# EAGLE schematic circadian rev2.0 (EAGLE 9.5.1)

## Sheet 1 of 6: LEDs
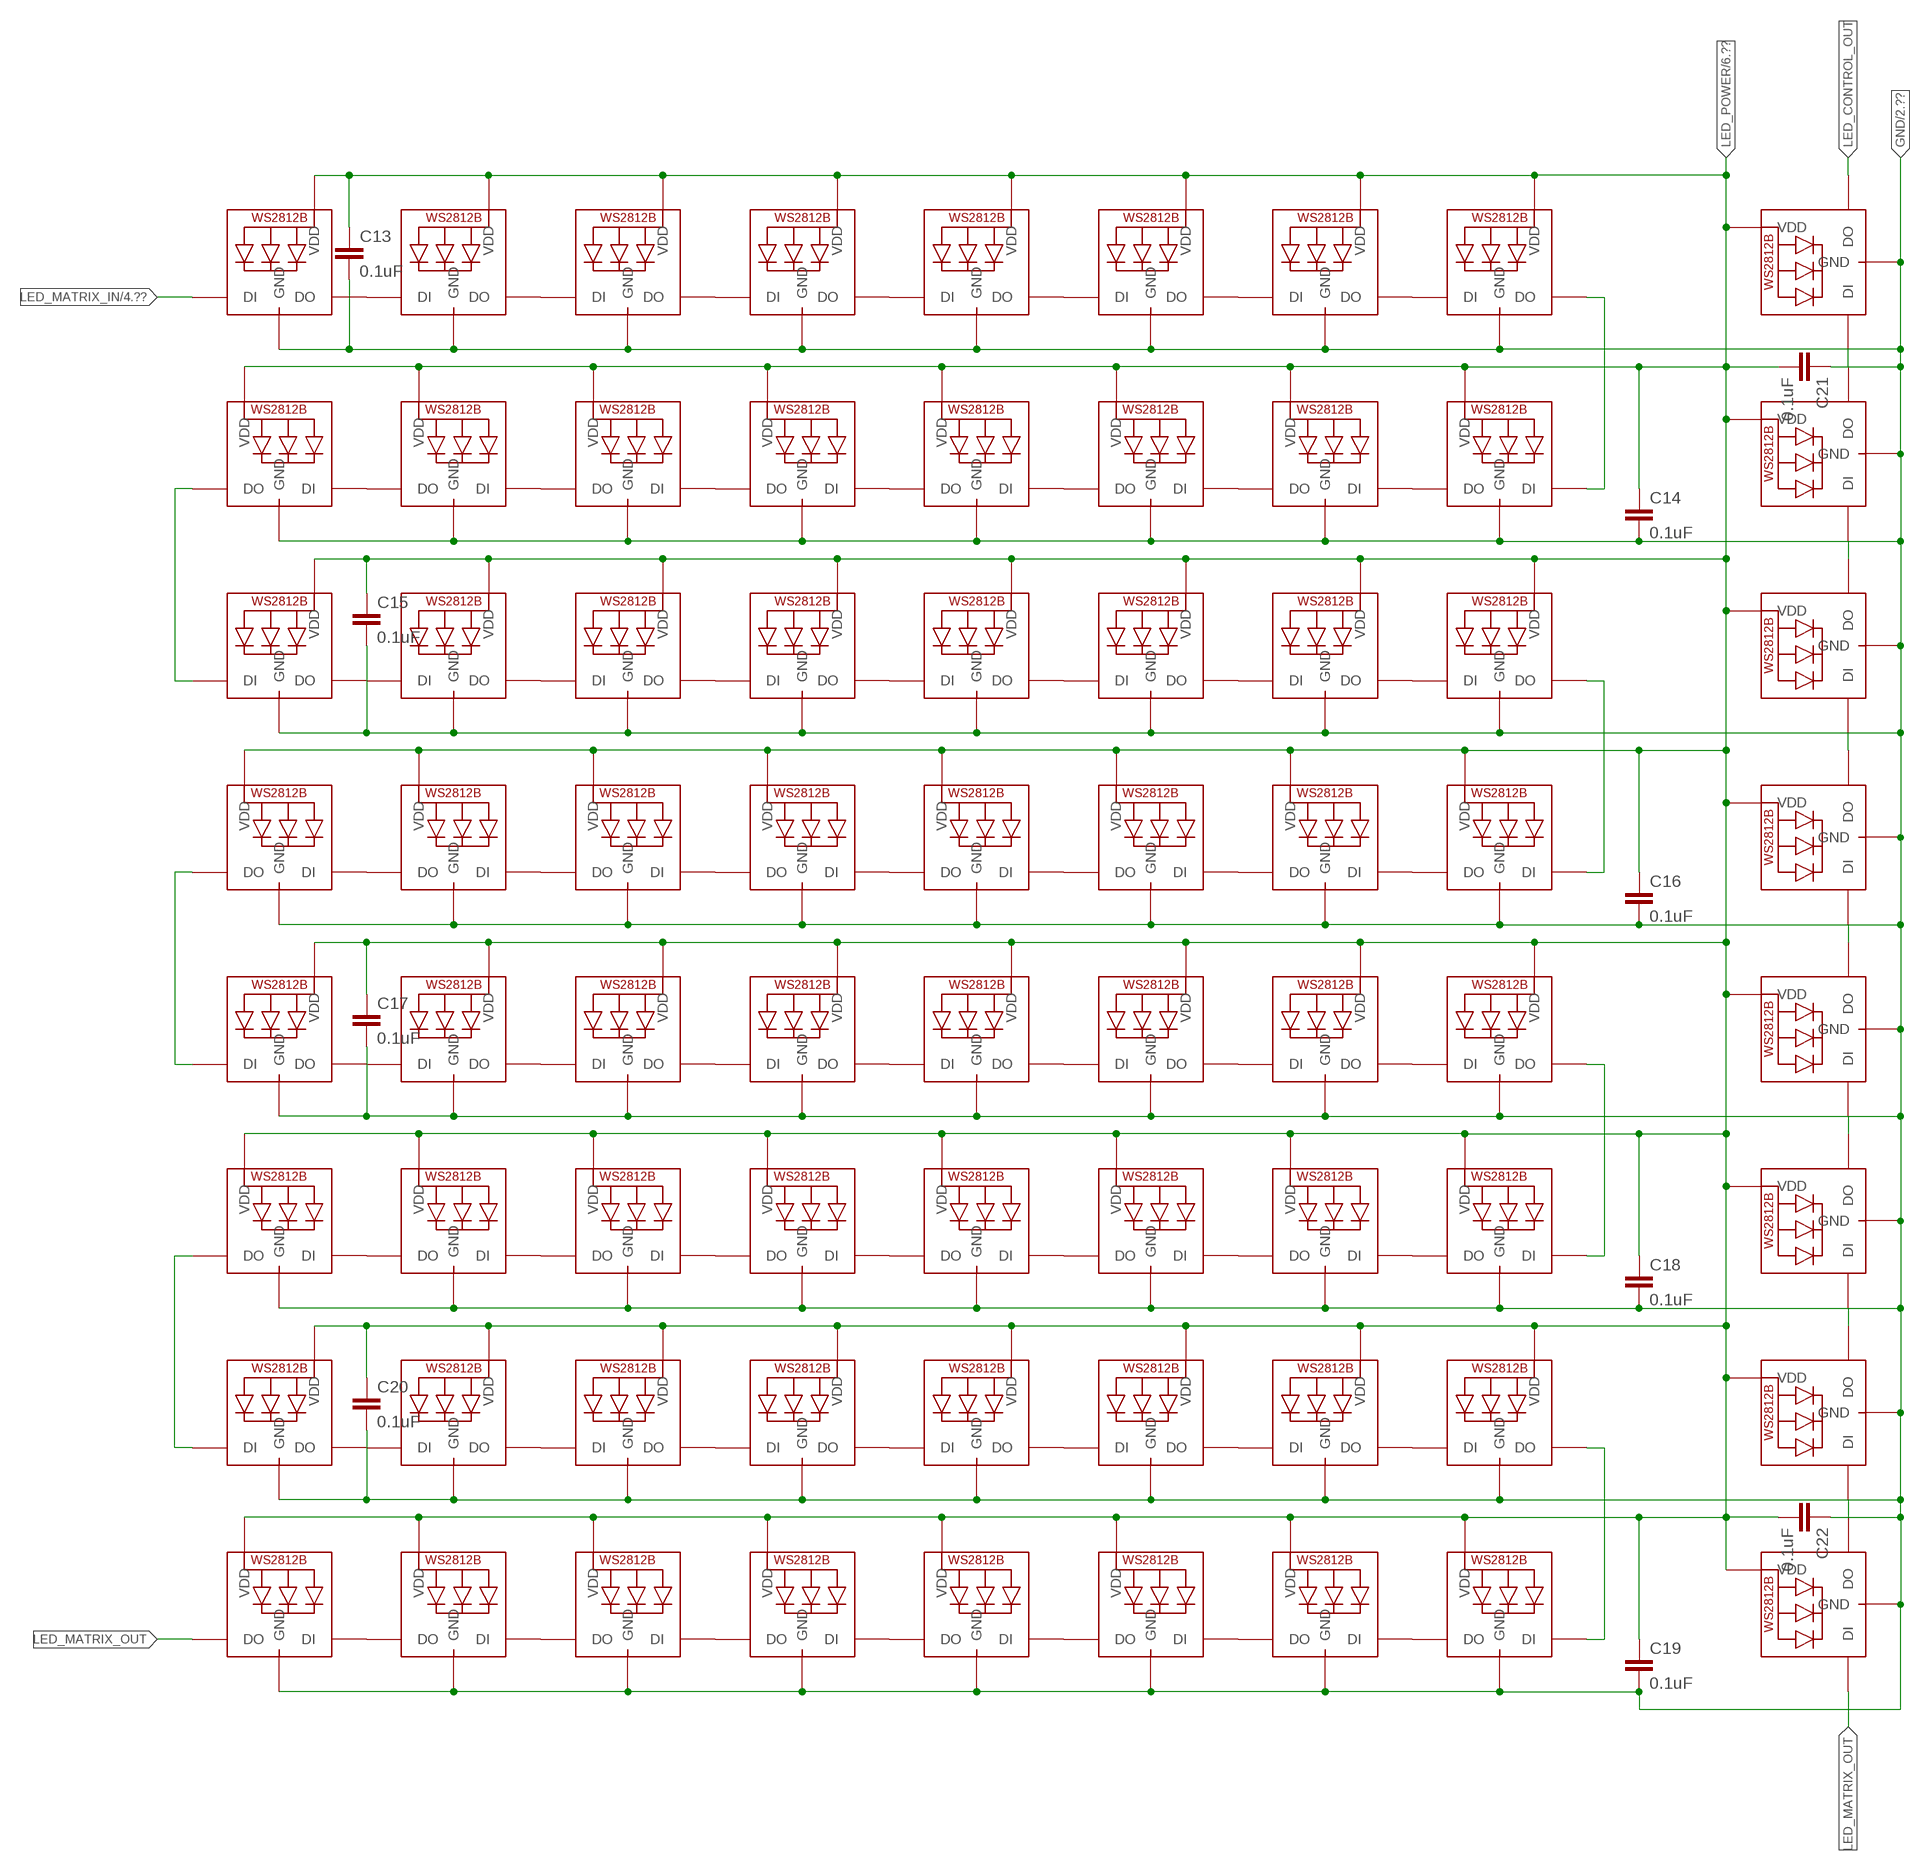
[diagram p0: schematic, sheet 1]

### Parts
C13  0.1uF  0.1UF-0603-25V-(+80/-20%)  [0603]
C14  0.1uF  0.1UF-0603-25V-(+80/-20%)  [0603]
C15  0.1uF  0.1UF-0603-25V-(+80/-20%)  [0603]
C16  0.1uF  0.1UF-0603-25V-(+80/-20%)  [0603]
C17  0.1uF  0.1UF-0603-25V-(+80/-20%)  [0603]
C18  0.1uF  0.1UF-0603-25V-(+80/-20%)  [0603]
C19  0.1uF  0.1UF-0603-25V-(+80/-20%)  [0603]
C20  0.1uF  0.1UF-0603-25V-(+80/-20%)  [0603]
C21  0.1uF  0.1UF-0603-25V-(+80/-20%)  [0603]
C22  0.1uF  0.1UF-0603-25V-(+80/-20%)  [0603]
LED1  WS2812B3535  [LED3535]
LED2  WS2812B3535  [LED3535]
LED3  WS2812B3535  [LED3535]
LED4  WS2812B3535  [LED3535]
LED5  WS2812B3535  [LED3535]
LED6  WS2812B3535  [LED3535]
LED7  WS2812B3535  [LED3535]
LED8  WS2812B3535  [LED3535]
LED9  WS2812B3535  [LED3535]
LED10  WS2812B3535  [LED3535]
LED11  WS2812B3535  [LED3535]
LED12  WS2812B3535  [LED3535]
LED13  WS2812B3535  [LED3535]
LED14  WS2812B3535  [LED3535]
LED15  WS2812B3535  [LED3535]
LED16  WS2812B3535  [LED3535]
LED17  WS2812B3535  [LED3535]
LED18  WS2812B3535  [LED3535]
LED19  WS2812B3535  [LED3535]
LED20  WS2812B3535  [LED3535]
LED21  WS2812B3535  [LED3535]
LED22  WS2812B3535  [LED3535]
LED23  WS2812B3535  [LED3535]
LED24  WS2812B3535  [LED3535]
LED25  WS2812B3535  [LED3535]
LED26  WS2812B3535  [LED3535]
LED27  WS2812B3535  [LED3535]
LED28  WS2812B3535  [LED3535]
LED29  WS2812B3535  [LED3535]
LED30  WS2812B3535  [LED3535]
LED31  WS2812B3535  [LED3535]
LED32  WS2812B3535  [LED3535]
LED33  WS2812B3535  [LED3535]
LED34  WS2812B3535  [LED3535]
LED35  WS2812B3535  [LED3535]
LED36  WS2812B3535  [LED3535]
LED37  WS2812B3535  [LED3535]
LED38  WS2812B3535  [LED3535]
LED39  WS2812B3535  [LED3535]
LED40  WS2812B3535  [LED3535]
LED41  WS2812B3535  [LED3535]
LED42  WS2812B3535  [LED3535]
LED43  WS2812B3535  [LED3535]
LED44  WS2812B3535  [LED3535]
LED45  WS2812B3535  [LED3535]
LED46  WS2812B3535  [LED3535]
LED47  WS2812B3535  [LED3535]
LED48  WS2812B3535  [LED3535]
LED49  WS2812B3535  [LED3535]
LED50  WS2812B3535  [LED3535]
LED51  WS2812B3535  [LED3535]
LED52  WS2812B3535  [LED3535]
LED53  WS2812B3535  [LED3535]
LED54  WS2812B3535  [LED3535]
LED55  WS2812B3535  [LED3535]
LED56  WS2812B3535  [LED3535]
LED57  WS2812B3535  [LED3535]
LED58  WS2812B3535  [LED3535]
LED59  WS2812B3535  [LED3535]
LED60  WS2812B3535  [LED3535]
LED61  WS2812B3535  [LED3535]
LED62  WS2812B3535  [LED3535]
LED63  WS2812B3535  [LED3535]
LED64  WS2812B3535  [LED3535]
LED65  WS2812B3535  [LED3535]
LED66  WS2812B3535  [LED3535]
LED67  WS2812B3535  [LED3535]
LED68  WS2812B3535  [LED3535]
LED69  WS2812B3535  [LED3535]
LED70  WS2812B3535  [LED3535]
LED71  WS2812B3535  [LED3535]
LED72  WS2812B3535  [LED3535]

### Nets
GND: C13.2 C14.2 C15.2 C16.2 C17.2 C18.2 C19.2 C20.2 C21.1 C22.1 LED1.4(GND) LED2.4(GND) LED3.4(GND) LED4.4(GND) LED5.4(GND) LED6.4(GND) LED7.4(GND) LED8.4(GND) LED9.4(GND) LED10.4(GND) LED11.4(GND) LED12.4(GND) LED13.4(GND) LED14.4(GND) LED15.4(GND) LED16.4(GND) LED17.4(GND) LED18.4(GND) LED19.4(GND) LED20.4(GND) LED21.4(GND) LED22.4(GND) LED23.4(GND) LED24.4(GND) LED25.4(GND) LED26.4(GND) LED27.4(GND) LED28.4(GND) LED29.4(GND) LED30.4(GND) LED31.4(GND) LED32.4(GND) LED33.4(GND) LED34.4(GND) LED35.4(GND) LED36.4(GND) LED37.4(GND) LED38.4(GND) LED39.4(GND) LED40.4(GND) LED41.4(GND) LED42.4(GND) LED43.4(GND) LED44.4(GND) LED45.4(GND) LED46.4(GND) LED47.4(GND) LED48.4(GND) LED49.4(GND) LED50.4(GND) LED51.4(GND) LED52.4(GND) LED53.4(GND) LED54.4(GND) LED55.4(GND) LED56.4(GND) LED57.4(GND) LED58.4(GND) LED59.4(GND) LED60.4(GND) LED61.4(GND) LED62.4(GND) LED63.4(GND) LED64.4(GND) LED65.4(GND) LED66.4(GND) LED67.4(GND) LED68.4(GND) LED69.4(GND) LED70.4(GND) LED71.4(GND) LED72.4(GND) ; also sheet 2,3,4,5,6
LED_CONTROL_OUT: LED65.3(DO)
LED_MATRIX_IN: LED1.1(DI) ; also sheet 4
LED_MATRIX_OUT: LED64.3(DO) LED72.1(DI)
LED_POWER: C13.1 C14.1 C15.1 C16.1 C17.1 C18.1 C19.1 C20.1 C21.2 C22.2 LED1.2(VDD) LED2.2(VDD) LED3.2(VDD) LED4.2(VDD) LED5.2(VDD) LED6.2(VDD) LED7.2(VDD) LED8.2(VDD) LED9.2(VDD) LED10.2(VDD) LED11.2(VDD) LED12.2(VDD) LED13.2(VDD) LED14.2(VDD) LED15.2(VDD) LED16.2(VDD) LED17.2(VDD) LED18.2(VDD) LED19.2(VDD) LED20.2(VDD) LED21.2(VDD) LED22.2(VDD) LED23.2(VDD) LED24.2(VDD) LED25.2(VDD) LED26.2(VDD) LED27.2(VDD) LED28.2(VDD) LED29.2(VDD) LED30.2(VDD) LED31.2(VDD) LED32.2(VDD) LED33.2(VDD) LED34.2(VDD) LED35.2(VDD) LED36.2(VDD) LED37.2(VDD) LED38.2(VDD) LED39.2(VDD) LED40.2(VDD) LED41.2(VDD) LED42.2(VDD) LED43.2(VDD) LED44.2(VDD) LED45.2(VDD) LED46.2(VDD) LED47.2(VDD) LED48.2(VDD) LED49.2(VDD) LED50.2(VDD) LED51.2(VDD) LED52.2(VDD) LED53.2(VDD) LED54.2(VDD) LED55.2(VDD) LED56.2(VDD) LED57.2(VDD) LED58.2(VDD) LED59.2(VDD) LED60.2(VDD) LED61.2(VDD) LED62.2(VDD) LED63.2(VDD) LED64.2(VDD) LED65.2(VDD) LED66.2(VDD) LED67.2(VDD) LED68.2(VDD) LED69.2(VDD) LED70.2(VDD) LED71.2(VDD) LED72.2(VDD) ; also sheet 6
N$3: LED9.3(DO) LED10.1(DI)
N$4: LED10.3(DO) LED11.1(DI)
N$5: LED11.3(DO) LED12.1(DI)
N$6: LED12.3(DO) LED13.1(DI)
N$7: LED13.3(DO) LED14.1(DI)
N$8: LED14.3(DO) LED15.1(DI)
N$9: LED15.3(DO) LED16.1(DI)
N$12: LED8.3(DO) LED9.1(DI)
N$13: LED17.3(DO) LED18.1(DI)
N$14: LED18.3(DO) LED19.1(DI)
N$15: LED19.3(DO) LED20.1(DI)
N$16: LED20.3(DO) LED21.1(DI)
N$17: LED21.3(DO) LED22.1(DI)
N$18: LED22.3(DO) LED23.1(DI)
N$19: LED23.3(DO) LED24.1(DI)
N$22: LED1.3(DO) LED2.1(DI)
N$23: LED2.3(DO) LED3.1(DI)
N$24: LED3.3(DO) LED4.1(DI)
N$25: LED4.3(DO) LED5.1(DI)
N$26: LED5.3(DO) LED6.1(DI)
N$27: LED6.3(DO) LED7.1(DI)
N$28: LED7.3(DO) LED8.1(DI)
N$29: LED25.3(DO) LED26.1(DI)
N$30: LED26.3(DO) LED27.1(DI)
N$31: LED27.3(DO) LED28.1(DI)
N$32: LED28.3(DO) LED29.1(DI)
N$33: LED29.3(DO) LED30.1(DI)
N$34: LED30.3(DO) LED31.1(DI)
N$35: LED31.3(DO) LED32.1(DI)
N$38: LED24.3(DO) LED25.1(DI)
N$39: LED33.3(DO) LED34.1(DI)
N$40: LED34.3(DO) LED35.1(DI)
N$41: LED35.3(DO) LED36.1(DI)
N$42: LED36.3(DO) LED37.1(DI)
N$43: LED37.3(DO) LED38.1(DI)
N$44: LED38.3(DO) LED39.1(DI)
N$45: LED39.3(DO) LED40.1(DI)
N$48: LED41.3(DO) LED42.1(DI)
N$49: LED42.3(DO) LED43.1(DI)
N$50: LED43.3(DO) LED44.1(DI)
N$51: LED44.3(DO) LED45.1(DI)
N$52: LED45.3(DO) LED46.1(DI)
N$53: LED46.3(DO) LED47.1(DI)
N$54: LED47.3(DO) LED48.1(DI)
N$57: LED40.3(DO) LED41.1(DI)
N$58: LED49.3(DO) LED50.1(DI)
N$59: LED50.3(DO) LED51.1(DI)
N$60: LED51.3(DO) LED52.1(DI)
N$61: LED52.3(DO) LED53.1(DI)
N$62: LED53.3(DO) LED54.1(DI)
N$63: LED54.3(DO) LED55.1(DI)
N$64: LED55.3(DO) LED56.1(DI)
N$67: LED57.3(DO) LED58.1(DI)
N$68: LED58.3(DO) LED59.1(DI)
N$69: LED59.3(DO) LED60.1(DI)
N$70: LED60.3(DO) LED61.1(DI)
N$71: LED61.3(DO) LED62.1(DI)
N$72: LED62.3(DO) LED63.1(DI)
N$73: LED63.3(DO) LED64.1(DI)
N$76: LED56.3(DO) LED57.1(DI)
N$77: LED16.3(DO) LED17.1(DI)
N$78: LED32.3(DO) LED33.1(DI)
N$79: LED48.3(DO) LED49.1(DI)
N$81: LED66.1(DI) LED67.3(DO)
N$82: LED67.1(DI) LED68.3(DO)
N$83: LED68.1(DI) LED69.3(DO)
N$84: LED69.1(DI) LED70.3(DO)
N$85: LED70.1(DI) LED71.3(DO)
N$86: LED71.1(DI) LED72.3(DO)
N$116: LED65.1(DI) LED66.3(DO)

## Sheet 2 of 6: Buttons
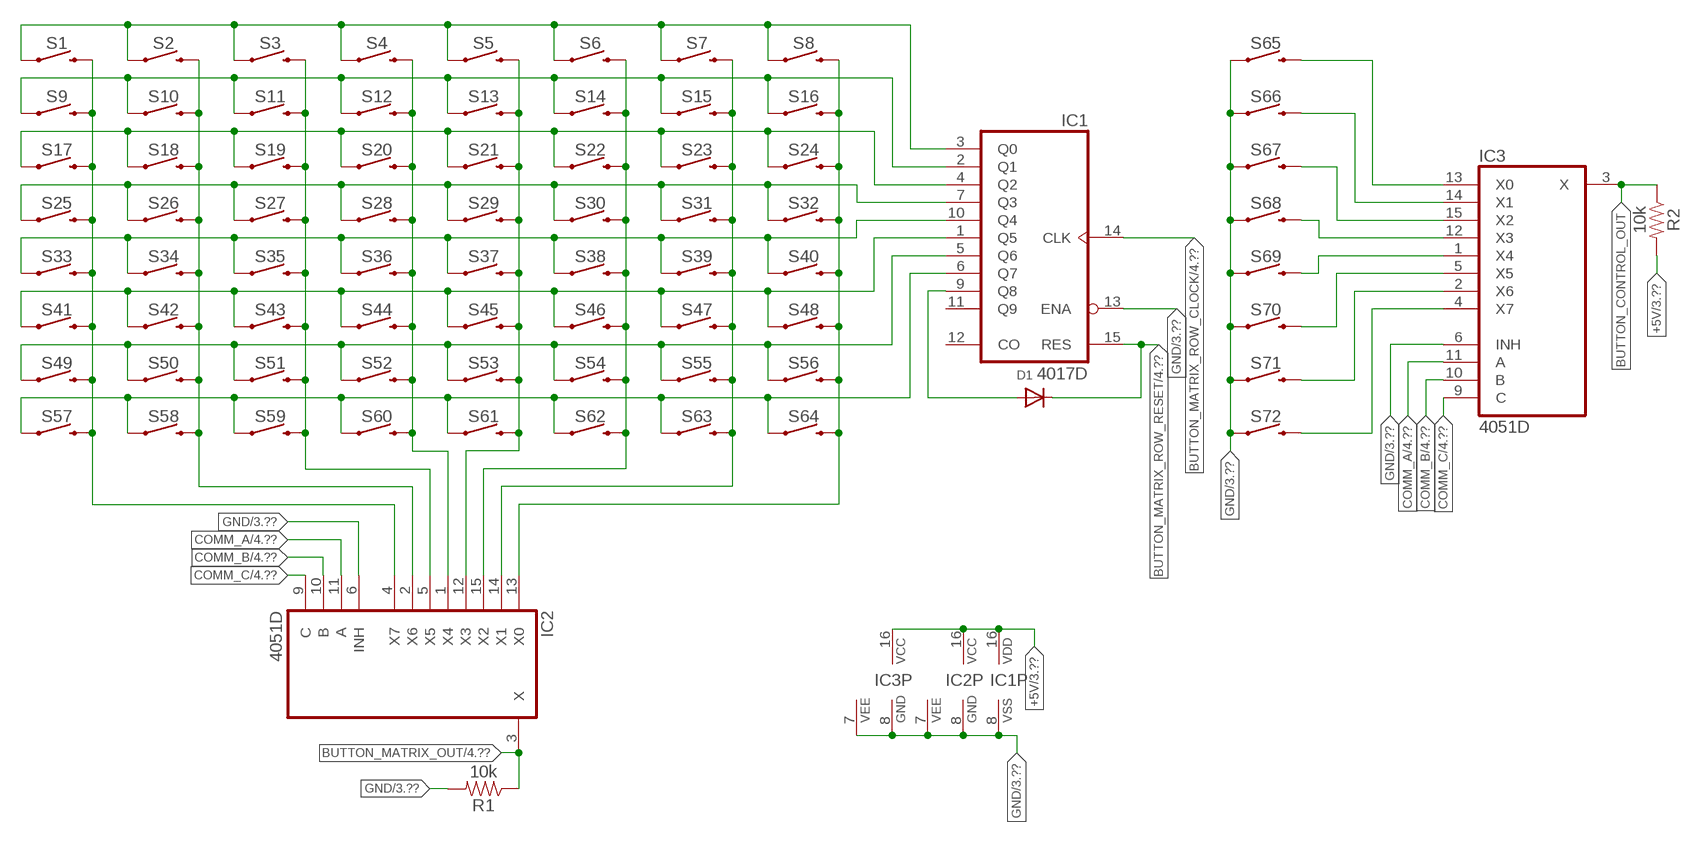
[diagram p1: schematic, sheet 2]

### Parts
D1  DIODESOD-123  [SOD-123]
IC1  4017D  [SO16]
IC2  4051D  [SO16]
IC3  4051D  [SO16]
R1  10k  10KOHM-0603-1/10W-1%  [0603]
R2  10k  10KOHM-0603-1/10W-1%  [0603]
S1  MOMENTARY-SWITCH-SPST-SMD-6.0X3.5MM  [TACTILE_SWITCH_SMD_6.0X3.5MM]
S2  MOMENTARY-SWITCH-SPST-SMD-6.0X3.5MM  [TACTILE_SWITCH_SMD_6.0X3.5MM]
S3  MOMENTARY-SWITCH-SPST-SMD-6.0X3.5MM  [TACTILE_SWITCH_SMD_6.0X3.5MM]
S4  MOMENTARY-SWITCH-SPST-SMD-6.0X3.5MM  [TACTILE_SWITCH_SMD_6.0X3.5MM]
S5  MOMENTARY-SWITCH-SPST-SMD-6.0X3.5MM  [TACTILE_SWITCH_SMD_6.0X3.5MM]
S6  MOMENTARY-SWITCH-SPST-SMD-6.0X3.5MM  [TACTILE_SWITCH_SMD_6.0X3.5MM]
S7  MOMENTARY-SWITCH-SPST-SMD-6.0X3.5MM  [TACTILE_SWITCH_SMD_6.0X3.5MM]
S8  MOMENTARY-SWITCH-SPST-SMD-6.0X3.5MM  [TACTILE_SWITCH_SMD_6.0X3.5MM]
S9  MOMENTARY-SWITCH-SPST-SMD-6.0X3.5MM  [TACTILE_SWITCH_SMD_6.0X3.5MM]
S10  MOMENTARY-SWITCH-SPST-SMD-6.0X3.5MM  [TACTILE_SWITCH_SMD_6.0X3.5MM]
S11  MOMENTARY-SWITCH-SPST-SMD-6.0X3.5MM  [TACTILE_SWITCH_SMD_6.0X3.5MM]
S12  MOMENTARY-SWITCH-SPST-SMD-6.0X3.5MM  [TACTILE_SWITCH_SMD_6.0X3.5MM]
S13  MOMENTARY-SWITCH-SPST-SMD-6.0X3.5MM  [TACTILE_SWITCH_SMD_6.0X3.5MM]
S14  MOMENTARY-SWITCH-SPST-SMD-6.0X3.5MM  [TACTILE_SWITCH_SMD_6.0X3.5MM]
S15  MOMENTARY-SWITCH-SPST-SMD-6.0X3.5MM  [TACTILE_SWITCH_SMD_6.0X3.5MM]
S16  MOMENTARY-SWITCH-SPST-SMD-6.0X3.5MM  [TACTILE_SWITCH_SMD_6.0X3.5MM]
S17  MOMENTARY-SWITCH-SPST-SMD-6.0X3.5MM  [TACTILE_SWITCH_SMD_6.0X3.5MM]
S18  MOMENTARY-SWITCH-SPST-SMD-6.0X3.5MM  [TACTILE_SWITCH_SMD_6.0X3.5MM]
S19  MOMENTARY-SWITCH-SPST-SMD-6.0X3.5MM  [TACTILE_SWITCH_SMD_6.0X3.5MM]
S20  MOMENTARY-SWITCH-SPST-SMD-6.0X3.5MM  [TACTILE_SWITCH_SMD_6.0X3.5MM]
S21  MOMENTARY-SWITCH-SPST-SMD-6.0X3.5MM  [TACTILE_SWITCH_SMD_6.0X3.5MM]
S22  MOMENTARY-SWITCH-SPST-SMD-6.0X3.5MM  [TACTILE_SWITCH_SMD_6.0X3.5MM]
S23  MOMENTARY-SWITCH-SPST-SMD-6.0X3.5MM  [TACTILE_SWITCH_SMD_6.0X3.5MM]
S24  MOMENTARY-SWITCH-SPST-SMD-6.0X3.5MM  [TACTILE_SWITCH_SMD_6.0X3.5MM]
S25  MOMENTARY-SWITCH-SPST-SMD-6.0X3.5MM  [TACTILE_SWITCH_SMD_6.0X3.5MM]
S26  MOMENTARY-SWITCH-SPST-SMD-6.0X3.5MM  [TACTILE_SWITCH_SMD_6.0X3.5MM]
S27  MOMENTARY-SWITCH-SPST-SMD-6.0X3.5MM  [TACTILE_SWITCH_SMD_6.0X3.5MM]
S28  MOMENTARY-SWITCH-SPST-SMD-6.0X3.5MM  [TACTILE_SWITCH_SMD_6.0X3.5MM]
S29  MOMENTARY-SWITCH-SPST-SMD-6.0X3.5MM  [TACTILE_SWITCH_SMD_6.0X3.5MM]
S30  MOMENTARY-SWITCH-SPST-SMD-6.0X3.5MM  [TACTILE_SWITCH_SMD_6.0X3.5MM]
S31  MOMENTARY-SWITCH-SPST-SMD-6.0X3.5MM  [TACTILE_SWITCH_SMD_6.0X3.5MM]
S32  MOMENTARY-SWITCH-SPST-SMD-6.0X3.5MM  [TACTILE_SWITCH_SMD_6.0X3.5MM]
S33  MOMENTARY-SWITCH-SPST-SMD-6.0X3.5MM  [TACTILE_SWITCH_SMD_6.0X3.5MM]
S34  MOMENTARY-SWITCH-SPST-SMD-6.0X3.5MM  [TACTILE_SWITCH_SMD_6.0X3.5MM]
S35  MOMENTARY-SWITCH-SPST-SMD-6.0X3.5MM  [TACTILE_SWITCH_SMD_6.0X3.5MM]
S36  MOMENTARY-SWITCH-SPST-SMD-6.0X3.5MM  [TACTILE_SWITCH_SMD_6.0X3.5MM]
S37  MOMENTARY-SWITCH-SPST-SMD-6.0X3.5MM  [TACTILE_SWITCH_SMD_6.0X3.5MM]
S38  MOMENTARY-SWITCH-SPST-SMD-6.0X3.5MM  [TACTILE_SWITCH_SMD_6.0X3.5MM]
S39  MOMENTARY-SWITCH-SPST-SMD-6.0X3.5MM  [TACTILE_SWITCH_SMD_6.0X3.5MM]
S40  MOMENTARY-SWITCH-SPST-SMD-6.0X3.5MM  [TACTILE_SWITCH_SMD_6.0X3.5MM]
S41  MOMENTARY-SWITCH-SPST-SMD-6.0X3.5MM  [TACTILE_SWITCH_SMD_6.0X3.5MM]
S42  MOMENTARY-SWITCH-SPST-SMD-6.0X3.5MM  [TACTILE_SWITCH_SMD_6.0X3.5MM]
S43  MOMENTARY-SWITCH-SPST-SMD-6.0X3.5MM  [TACTILE_SWITCH_SMD_6.0X3.5MM]
S44  MOMENTARY-SWITCH-SPST-SMD-6.0X3.5MM  [TACTILE_SWITCH_SMD_6.0X3.5MM]
S45  MOMENTARY-SWITCH-SPST-SMD-6.0X3.5MM  [TACTILE_SWITCH_SMD_6.0X3.5MM]
S46  MOMENTARY-SWITCH-SPST-SMD-6.0X3.5MM  [TACTILE_SWITCH_SMD_6.0X3.5MM]
S47  MOMENTARY-SWITCH-SPST-SMD-6.0X3.5MM  [TACTILE_SWITCH_SMD_6.0X3.5MM]
S48  MOMENTARY-SWITCH-SPST-SMD-6.0X3.5MM  [TACTILE_SWITCH_SMD_6.0X3.5MM]
S49  MOMENTARY-SWITCH-SPST-SMD-6.0X3.5MM  [TACTILE_SWITCH_SMD_6.0X3.5MM]
S50  MOMENTARY-SWITCH-SPST-SMD-6.0X3.5MM  [TACTILE_SWITCH_SMD_6.0X3.5MM]
S51  MOMENTARY-SWITCH-SPST-SMD-6.0X3.5MM  [TACTILE_SWITCH_SMD_6.0X3.5MM]
S52  MOMENTARY-SWITCH-SPST-SMD-6.0X3.5MM  [TACTILE_SWITCH_SMD_6.0X3.5MM]
S53  MOMENTARY-SWITCH-SPST-SMD-6.0X3.5MM  [TACTILE_SWITCH_SMD_6.0X3.5MM]
S54  MOMENTARY-SWITCH-SPST-SMD-6.0X3.5MM  [TACTILE_SWITCH_SMD_6.0X3.5MM]
S55  MOMENTARY-SWITCH-SPST-SMD-6.0X3.5MM  [TACTILE_SWITCH_SMD_6.0X3.5MM]
S56  MOMENTARY-SWITCH-SPST-SMD-6.0X3.5MM  [TACTILE_SWITCH_SMD_6.0X3.5MM]
S57  MOMENTARY-SWITCH-SPST-SMD-6.0X3.5MM  [TACTILE_SWITCH_SMD_6.0X3.5MM]
S58  MOMENTARY-SWITCH-SPST-SMD-6.0X3.5MM  [TACTILE_SWITCH_SMD_6.0X3.5MM]
S59  MOMENTARY-SWITCH-SPST-SMD-6.0X3.5MM  [TACTILE_SWITCH_SMD_6.0X3.5MM]
S60  MOMENTARY-SWITCH-SPST-SMD-6.0X3.5MM  [TACTILE_SWITCH_SMD_6.0X3.5MM]
S61  MOMENTARY-SWITCH-SPST-SMD-6.0X3.5MM  [TACTILE_SWITCH_SMD_6.0X3.5MM]
S62  MOMENTARY-SWITCH-SPST-SMD-6.0X3.5MM  [TACTILE_SWITCH_SMD_6.0X3.5MM]
S63  MOMENTARY-SWITCH-SPST-SMD-6.0X3.5MM  [TACTILE_SWITCH_SMD_6.0X3.5MM]
S64  MOMENTARY-SWITCH-SPST-SMD-6.0X3.5MM  [TACTILE_SWITCH_SMD_6.0X3.5MM]
S65  MOMENTARY-SWITCH-SPST-SMD-6.0X3.5MM  [TACTILE_SWITCH_SMD_6.0X3.5MM]
S66  MOMENTARY-SWITCH-SPST-SMD-6.0X3.5MM  [TACTILE_SWITCH_SMD_6.0X3.5MM]
S67  MOMENTARY-SWITCH-SPST-SMD-6.0X3.5MM  [TACTILE_SWITCH_SMD_6.0X3.5MM]
S68  MOMENTARY-SWITCH-SPST-SMD-6.0X3.5MM  [TACTILE_SWITCH_SMD_6.0X3.5MM]
S69  MOMENTARY-SWITCH-SPST-SMD-6.0X3.5MM  [TACTILE_SWITCH_SMD_6.0X3.5MM]
S70  MOMENTARY-SWITCH-SPST-SMD-6.0X3.5MM  [TACTILE_SWITCH_SMD_6.0X3.5MM]
S71  MOMENTARY-SWITCH-SPST-SMD-6.0X3.5MM  [TACTILE_SWITCH_SMD_6.0X3.5MM]
S72  MOMENTARY-SWITCH-SPST-SMD-6.0X3.5MM  [TACTILE_SWITCH_SMD_6.0X3.5MM]

### Nets
+5V: IC1.16(VDD) IC2.16(VCC) IC3.16(VCC) R2.2 ; also sheet 3,4,5,6
BUTTON_CONTROL_OUT: IC3.3(X) R2.1
BUTTON_MATRIX_COLLUM1: IC2.4(X7) S1.2 S9.2 S17.2 S25.2 S33.2 S41.2 S49.2 S57.2
BUTTON_MATRIX_COLLUM2: IC2.2(X6) S2.2 S10.2 S18.2 S26.2 S34.2 S42.2 S50.2 S58.2
BUTTON_MATRIX_COLLUM3: IC2.5(X5) S3.2 S11.2 S19.2 S27.2 S35.2 S43.2 S51.2 S59.2
BUTTON_MATRIX_COLLUM4: IC2.1(X4) S4.2 S12.2 S20.2 S28.2 S36.2 S44.2 S52.2 S60.2
BUTTON_MATRIX_COLLUM5: IC2.12(X3) S5.2 S13.2 S21.2 S29.2 S37.2 S45.2 S53.2 S61.2
BUTTON_MATRIX_COLLUM6: IC2.15(X2) S6.2 S14.2 S22.2 S30.2 S38.2 S46.2 S54.2 S62.2
BUTTON_MATRIX_COLLUM7: IC2.14(X1) S7.2 S15.2 S23.2 S31.2 S39.2 S47.2 S55.2 S63.2
BUTTON_MATRIX_COLLUM8: IC2.13(X0) S8.2 S16.2 S24.2 S32.2 S40.2 S48.2 S56.2 S64.2
BUTTON_MATRIX_OUT: IC2.3(X) R1.1 ; also sheet 4
BUTTON_MATRIX_ROW1: IC1.3(Q0) S1.1 S2.1 S3.1 S4.1 S5.1 S6.1 S7.1 S8.1
BUTTON_MATRIX_ROW2: IC1.2(Q1) S9.1 S10.1 S11.1 S12.1 S13.1 S14.1 S15.1 S16.1
BUTTON_MATRIX_ROW3: IC1.4(Q2) S17.1 S18.1 S19.1 S20.1 S21.1 S22.1 S23.1 S24.1
BUTTON_MATRIX_ROW4: IC1.7(Q3) S25.1 S26.1 S27.1 S28.1 S29.1 S30.1 S31.1 S32.1
BUTTON_MATRIX_ROW5: IC1.10(Q4) S33.1 S34.1 S35.1 S36.1 S37.1 S38.1 S39.1 S40.1
BUTTON_MATRIX_ROW6: IC1.1(Q5) S41.1 S42.1 S43.1 S44.1 S45.1 S46.1 S47.1 S48.1
BUTTON_MATRIX_ROW7: IC1.5(Q6) S49.1 S50.1 S51.1 S52.1 S53.1 S54.1 S55.1 S56.1
BUTTON_MATRIX_ROW8: IC1.6(Q7) S57.1 S58.1 S59.1 S60.1 S61.1 S62.1 S63.1 S64.1
BUTTON_MATRIX_ROW_CLOCK: IC1.14(CLK) ; also sheet 4
BUTTON_MATRIX_ROW_RESET: D1.C IC1.15(RES) ; also sheet 4
COMM_A: IC2.11(A) IC3.11(A) ; also sheet 4
COMM_B: IC2.10(B) IC3.10(B) ; also sheet 4
COMM_C: IC2.9(C) IC3.9(C) ; also sheet 4
GND: IC1.8(VSS) IC1.13(ENA) IC2.6(INH) IC2.7(VEE) IC2.8(GND) IC3.6(INH) IC3.7(VEE) IC3.8(GND) R1.2 S65.1 S66.1 S67.1 S68.1 S69.1 S70.1 S71.1 S72.1 ; also sheet 1,3,4,5,6
N$2: IC3.12(X3) S68.2
N$10: IC3.1(X4) S69.2
N$11: IC3.5(X5) S70.2
N$20: IC3.15(X2) S67.2
N$21: IC3.14(X1) S66.2
N$36: IC3.13(X0) S65.2
N$37: IC3.2(X6) S71.2
N$46: IC3.4(X7) S72.2
N$102: D1.A IC1.9(Q8)
Unconnected: IC1.11(Q9) IC1.12(CO)

## Sheet 3 of 6: other UI
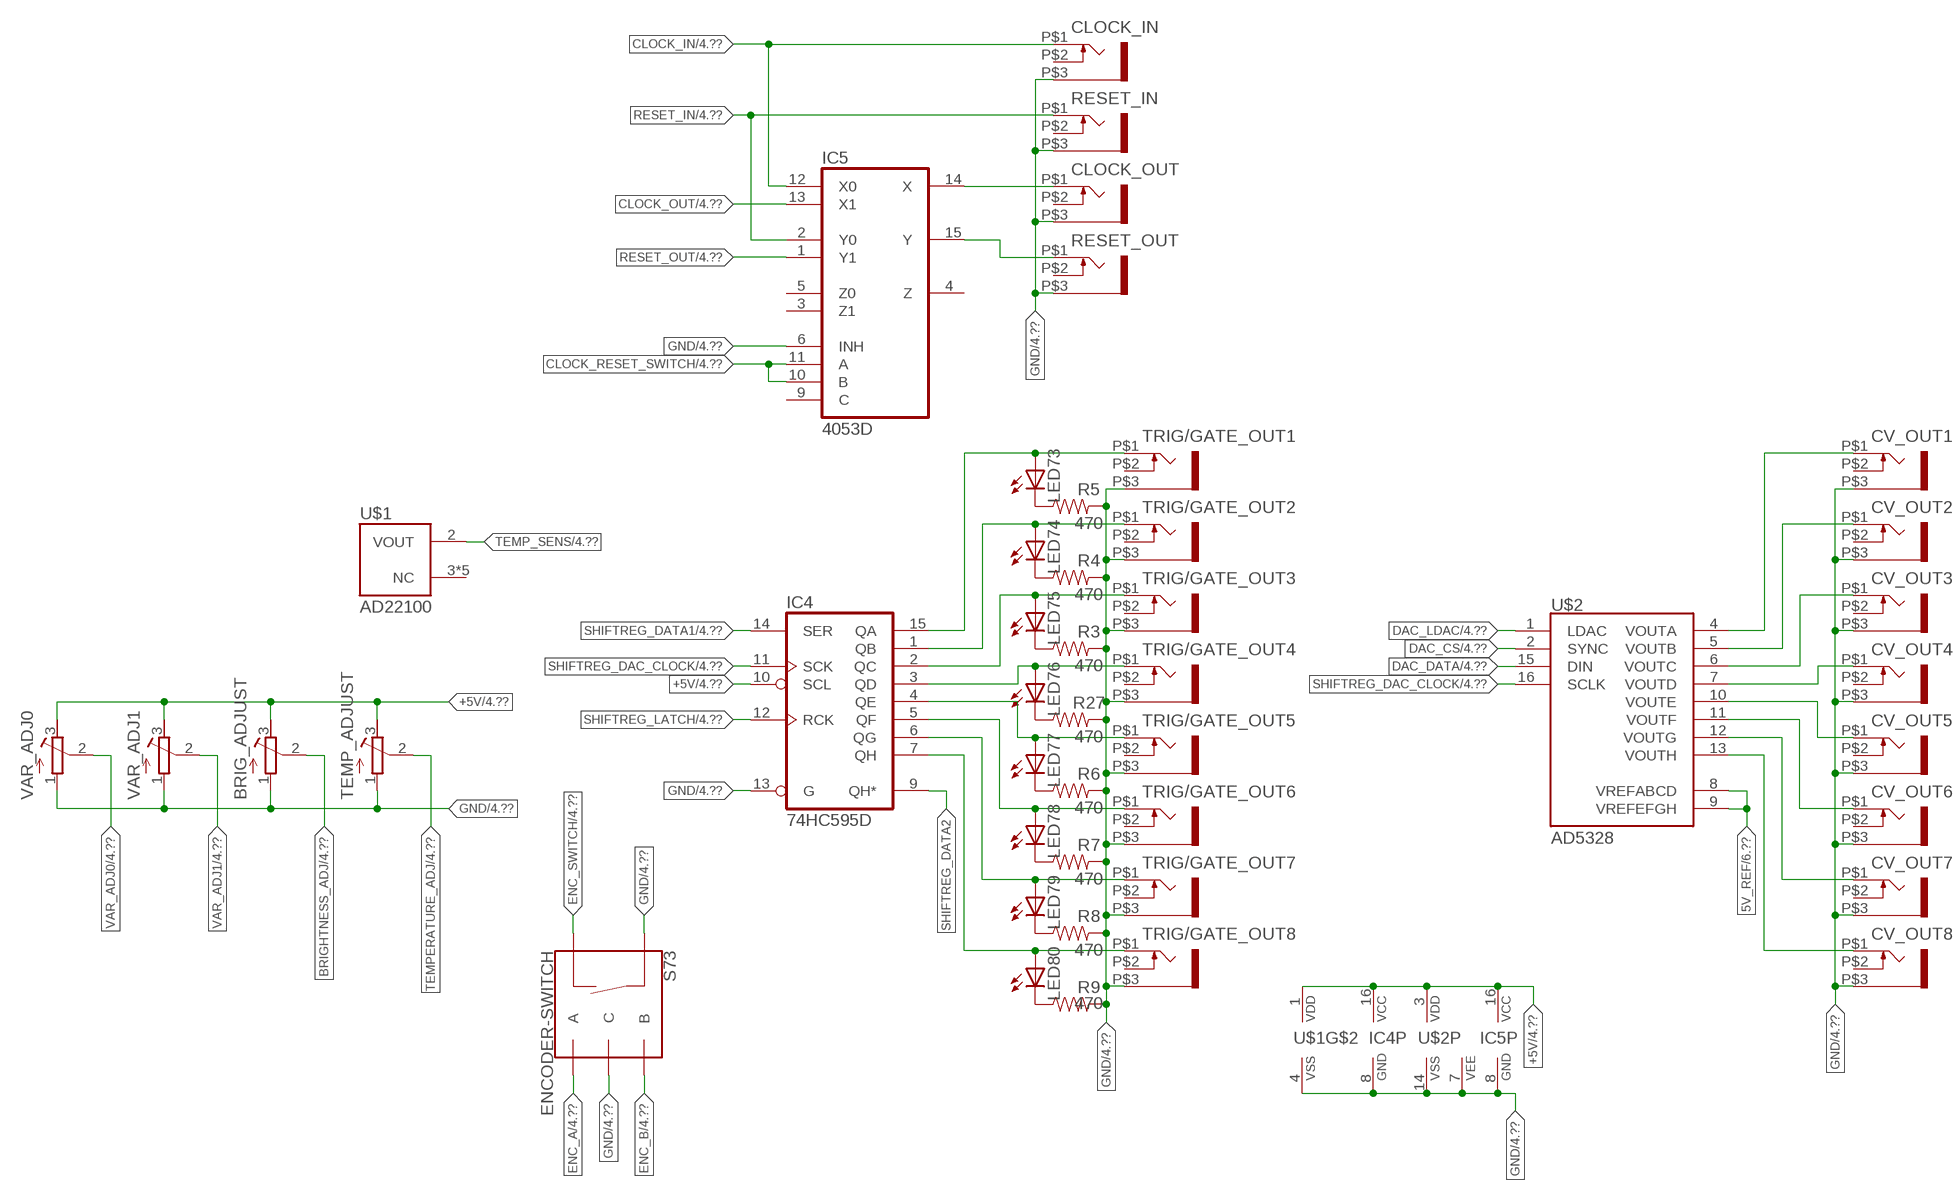
[diagram p2: schematic, sheet 3]

### Parts
BRIG_ADJUST  R-TRIMM4G/J  [RTRIM4G/J]
CLOCK_IN  WQP-PJ301M-12_JACK  [WQP-PJ301M-12_JACK]
CLOCK_OUT  WQP-PJ301M-12_JACK  [WQP-PJ301M-12_JACK]
CV_OUT1  WQP-PJ301M-12_JACK  [WQP-PJ301M-12_JACK]
CV_OUT2  WQP-PJ301M-12_JACK  [WQP-PJ301M-12_JACK]
CV_OUT3  WQP-PJ301M-12_JACK  [WQP-PJ301M-12_JACK]
CV_OUT4  WQP-PJ301M-12_JACK  [WQP-PJ301M-12_JACK]
CV_OUT5  WQP-PJ301M-12_JACK  [WQP-PJ301M-12_JACK]
CV_OUT6  WQP-PJ301M-12_JACK  [WQP-PJ301M-12_JACK]
CV_OUT7  WQP-PJ301M-12_JACK  [WQP-PJ301M-12_JACK]
CV_OUT8  WQP-PJ301M-12_JACK  [WQP-PJ301M-12_JACK]
IC4  74HC595D  [SO16]
IC5  4053D  [SO16]
LED73  LED5MM  [LED5MM]
LED74  LED5MM  [LED5MM]
LED75  LED5MM  [LED5MM]
LED76  LED5MM  [LED5MM]
LED77  LED5MM  [LED5MM]
LED78  LED5MM  [LED5MM]
LED79  LED5MM  [LED5MM]
LED80  LED5MM  [LED5MM]
R3  470  470OHM-0603-1/10W-1%  [0603]
R4  470  470OHM-0603-1/10W-1%  [0603]
R5  470  470OHM-0603-1/10W-1%  [0603]
R6  470  470OHM-0603-1/10W-1%  [0603]
R7  470  470OHM-0603-1/10W-1%  [0603]
R8  470  470OHM-0603-1/10W-1%  [0603]
R9  470  470OHM-0603-1/10W-1%  [0603]
R27  470  470OHM-0603-1/10W-1%  [0603]
RESET_IN  WQP-PJ301M-12_JACK  [WQP-PJ301M-12_JACK]
RESET_OUT  WQP-PJ301M-12_JACK  [WQP-PJ301M-12_JACK]
S73  ENCODER-SWITCH  [ROTARY_ENC_PLAIN]
TEMP_ADJUST  R-TRIMM4G/J  [RTRIM4G/J]
TRIG/GATE_OUT1  WQP-PJ301M-12_JACK  [WQP-PJ301M-12_JACK]
TRIG/GATE_OUT2  WQP-PJ301M-12_JACK  [WQP-PJ301M-12_JACK]
TRIG/GATE_OUT3  WQP-PJ301M-12_JACK  [WQP-PJ301M-12_JACK]
TRIG/GATE_OUT4  WQP-PJ301M-12_JACK  [WQP-PJ301M-12_JACK]
TRIG/GATE_OUT5  WQP-PJ301M-12_JACK  [WQP-PJ301M-12_JACK]
TRIG/GATE_OUT6  WQP-PJ301M-12_JACK  [WQP-PJ301M-12_JACK]
TRIG/GATE_OUT7  WQP-PJ301M-12_JACK  [WQP-PJ301M-12_JACK]
TRIG/GATE_OUT8  WQP-PJ301M-12_JACK  [WQP-PJ301M-12_JACK]
U$1  AD22100  [SO08]
U$2  AD5328  [TSSOP-16]
VAR_ADJ0  R-TRIMM4G/J  [RTRIM4G/J]
VAR_ADJ1  R-TRIMM4G/J  [RTRIM4G/J]

### Nets
5V_REF: U$2.8(VREFABCD) U$2.9(VREFEFGH) ; also sheet 6
+5V: BRIG_ADJUST.3(E) IC4.10(SCL) IC4.16(VCC) IC5.16(VCC) TEMP_ADJUST.3(E) U$1.1(VDD) U$2.3(VDD) VAR_ADJ0.3(E) VAR_ADJ1.3(E) ; also sheet 2,4,5,6
BRIGHTNESS_ADJ: BRIG_ADJUST.2(S) ; also sheet 4
CLOCK_IN: CLOCK_IN.P$1 IC5.12(X0) ; also sheet 4
CLOCK_OUT: IC5.13(X1) ; also sheet 4
CLOCK_RESET_SWITCH: IC5.10(B) IC5.11(A) ; also sheet 4
DAC_CS: U$2.2(SYNC) ; also sheet 4
DAC_DATA: U$2.15(DIN) ; also sheet 4
DAC_LDAC: U$2.1(LDAC) ; also sheet 4
ENC_A: S73.A ; also sheet 4
ENC_B: S73.B ; also sheet 4
ENC_SWITCH: S73.SW- ; also sheet 4
GND: BRIG_ADJUST.1(A) CLOCK_IN.P$3 CLOCK_OUT.P$3 CV_OUT1.P$3 CV_OUT2.P$3 CV_OUT3.P$3 CV_OUT4.P$3 CV_OUT5.P$3 CV_OUT6.P$3 CV_OUT7.P$3 CV_OUT8.P$3 IC4.8(GND) IC4.13(G) IC5.6(INH) IC5.7(VEE) IC5.8(GND) R3.2 R4.2 R5.2 R6.2 R7.2 R8.2 R9.2 R27.2 RESET_IN.P$3 RESET_OUT.P$3 S73.C S73.SW+ TEMP_ADJUST.1(A) TRIG/GATE_OUT1.P$3 TRIG/GATE_OUT2.P$3 TRIG/GATE_OUT3.P$3 TRIG/GATE_OUT4.P$3 TRIG/GATE_OUT5.P$3 TRIG/GATE_OUT6.P$3 TRIG/GATE_OUT7.P$3 TRIG/GATE_OUT8.P$3 U$1.4(VSS) U$2.14(VSS) VAR_ADJ0.1(A) VAR_ADJ1.1(A) ; also sheet 1,2,4,5,6
N$1: IC4.4(QE) LED77.A TRIG/GATE_OUT5.P$1
N$47: IC4.3(QD) LED76.A TRIG/GATE_OUT4.P$1
N$55: IC4.5(QF) LED78.A TRIG/GATE_OUT6.P$1
N$56: IC4.6(QG) LED79.A TRIG/GATE_OUT7.P$1
N$65: IC4.7(QH) LED80.A TRIG/GATE_OUT8.P$1
N$66: IC4.2(QC) LED75.A TRIG/GATE_OUT3.P$1
N$74: IC4.1(QB) LED74.A TRIG/GATE_OUT2.P$1
N$75: IC4.15(QA) LED73.A TRIG/GATE_OUT1.P$1
N$87: CV_OUT4.P$1 U$2.7(VOUTD)
N$88: CV_OUT5.P$1 U$2.10(VOUTE)
N$89: CV_OUT6.P$1 U$2.11(VOUTF)
N$90: CV_OUT7.P$1 U$2.12(VOUTG)
N$91: CV_OUT8.P$1 U$2.13(VOUTH)
N$92: CV_OUT3.P$1 U$2.6(VOUTC)
N$93: CV_OUT2.P$1 U$2.5(VOUTB)
N$94: CV_OUT1.P$1 U$2.4(VOUTA)
N$95: CLOCK_OUT.P$1 IC5.14(X)
N$96: IC5.15(Y) RESET_OUT.P$1
N$98: LED76.K(C) R27.1
N$100: LED75.K(C) R3.1
N$108: LED74.K(C) R4.1
N$109: LED73.K(C) R5.1
N$110: LED77.K(C) R6.1
N$111: LED78.K(C) R7.1
N$112: LED79.K(C) R8.1
N$113: LED80.K(C) R9.1
RESET_IN: IC5.2(Y0) RESET_IN.P$1 ; also sheet 4
RESET_OUT: IC5.1(Y1) ; also sheet 4
SHIFTREG_DAC_CLOCK: IC4.11(SCK) U$2.16(SCLK) ; also sheet 4
SHIFTREG_DATA1: IC4.14(SER) ; also sheet 4
SHIFTREG_DATA2: IC4.9(QH*)
SHIFTREG_LATCH: IC4.12(RCK) ; also sheet 4
TEMP_SENS: U$1.2(VOUT) ; also sheet 4
TEMPERATURE_ADJ: TEMP_ADJUST.2(S) ; also sheet 4
VAR_ADJ0: VAR_ADJ0.2(S) ; also sheet 4
VAR_ADJ1: VAR_ADJ1.2(S) ; also sheet 4
Unconnected: CLOCK_IN.P$2 CLOCK_OUT.P$2 CV_OUT1.P$2 CV_OUT2.P$2 CV_OUT3.P$2 CV_OUT4.P$2 CV_OUT5.P$2 CV_OUT6.P$2 CV_OUT7.P$2 CV_OUT8.P$2 IC5.3(Z1) IC5.4(Z) IC5.5(Z0) IC5.9(C) RESET_IN.P$2 RESET_OUT.P$2 TRIG/GATE_OUT1.P$2 TRIG/GATE_OUT2.P$2 TRIG/GATE_OUT3.P$2 TRIG/GATE_OUT4.P$2 TRIG/GATE_OUT5.P$2 TRIG/GATE_OUT6.P$2 TRIG/GATE_OUT7.P$2 TRIG/GATE_OUT8.P$2 U$1.3(NC) U$1.5(NC) U$1.6(NC) U$1.7(NC) U$1.8(NC)

## Sheet 4 of 6: MCU
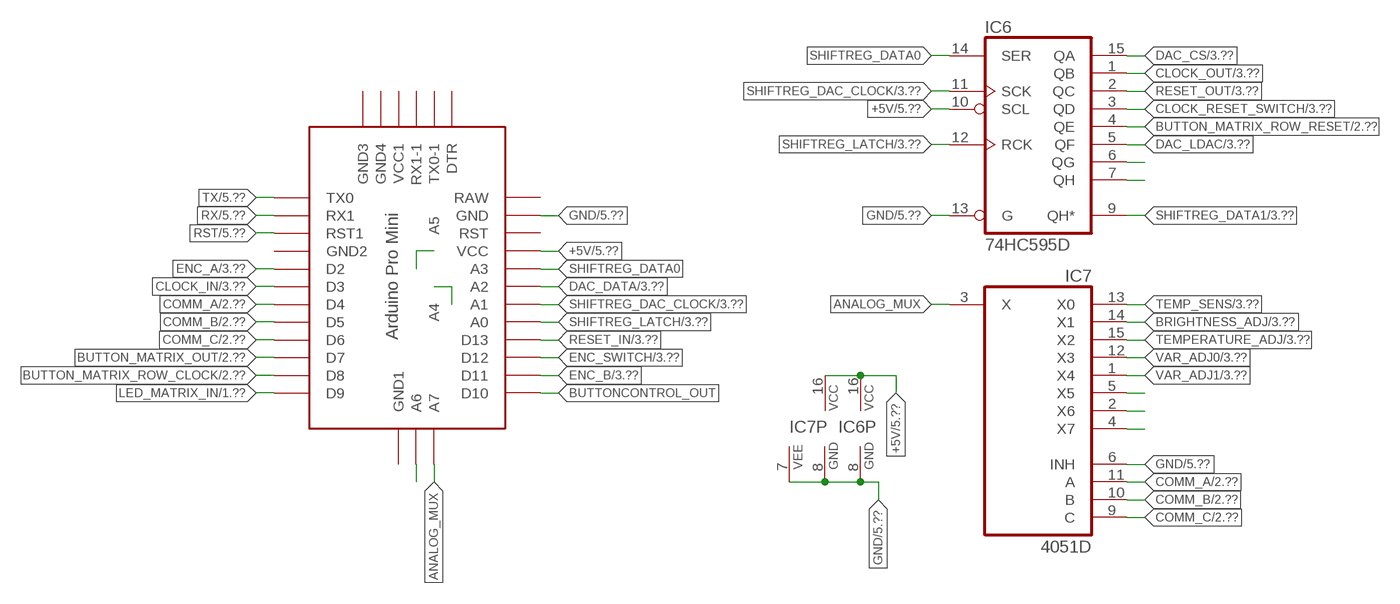
[diagram p3: schematic, sheet 4]

### Parts
IC6  74HC595D  [SO16]
IC7  4051D  [SO16]
U$3  ABK-PRO-MINI  [ABK-PRO-MINI]

### Nets
+5V: IC6.10(SCL) IC6.16(VCC) IC7.16(VCC) U$3.VCC ; also sheet 2,3,5,6
ANALOG_MUX: IC7.3(X) U$3.A7
BRIGHTNESS_ADJ: IC7.14(X1) ; also sheet 3
BUTTON_MATRIX_OUT: U$3.D7 ; also sheet 2
BUTTON_MATRIX_ROW_CLOCK: U$3.D8 ; also sheet 2
BUTTON_MATRIX_ROW_RESET: IC6.4(QE) ; also sheet 2
BUTTONCONTROL_OUT: U$3.D10
CLOCK_IN: U$3.D3 ; also sheet 3
CLOCK_OUT: IC6.1(QB) ; also sheet 3
CLOCK_RESET_SWITCH: IC6.3(QD) ; also sheet 3
COMM_A: IC7.11(A) U$3.D4 ; also sheet 2
COMM_B: IC7.10(B) U$3.D5 ; also sheet 2
COMM_C: IC7.9(C) U$3.D6 ; also sheet 2
DAC_CS: IC6.15(QA) ; also sheet 3
DAC_DATA: U$3.A2 ; also sheet 3
DAC_LDAC: IC6.5(QF) ; also sheet 3
ENC_A: U$3.D2 ; also sheet 3
ENC_B: U$3.D11 ; also sheet 3
ENC_SWITCH: U$3.D12 ; also sheet 3
GND: IC6.8(GND) IC6.13(G) IC7.6(INH) IC7.7(VEE) IC7.8(GND) U$3.GND ; also sheet 1,2,3,5,6
LED_MATRIX_IN: U$3.D9 ; also sheet 1
N$97: U$3.A5
N$99: U$3.A6
N$103: IC6.6(QG)
N$104: IC6.7(QH)
N$105: IC7.5(X5)
N$106: IC7.2(X6)
N$107: IC7.4(X7)
N$115: U$3.A4
RESET_IN: U$3.D13 ; also sheet 3
RESET_OUT: IC6.2(QC) ; also sheet 3
RST: U$3.RST1 ; also sheet 5
RX: U$3.RX1 ; also sheet 5
SHIFTREG_DAC_CLOCK: IC6.11(SCK) U$3.A1 ; also sheet 3
SHIFTREG_DATA0: IC6.14(SER) U$3.A3
SHIFTREG_DATA1: IC6.9(QH*) ; also sheet 3
SHIFTREG_LATCH: IC6.12(RCK) U$3.A0 ; also sheet 3
TEMP_SENS: IC7.13(X0) ; also sheet 3
TEMPERATURE_ADJ: IC7.15(X2) ; also sheet 3
TX: U$3.TX0 ; also sheet 5
VAR_ADJ0: IC7.12(X3) ; also sheet 3
VAR_ADJ1: IC7.1(X4) ; also sheet 3
Unconnected: U$3.DTR U$3.GND1(GND2) U$3.GND2(GND3) U$3.GND3(GND4) U$3.GND4(GND1) U$3.RAW U$3.RST U$3.RX1-1 U$3.TX0-1 U$3.VCC1

## Sheet 5 of 6: ftdi
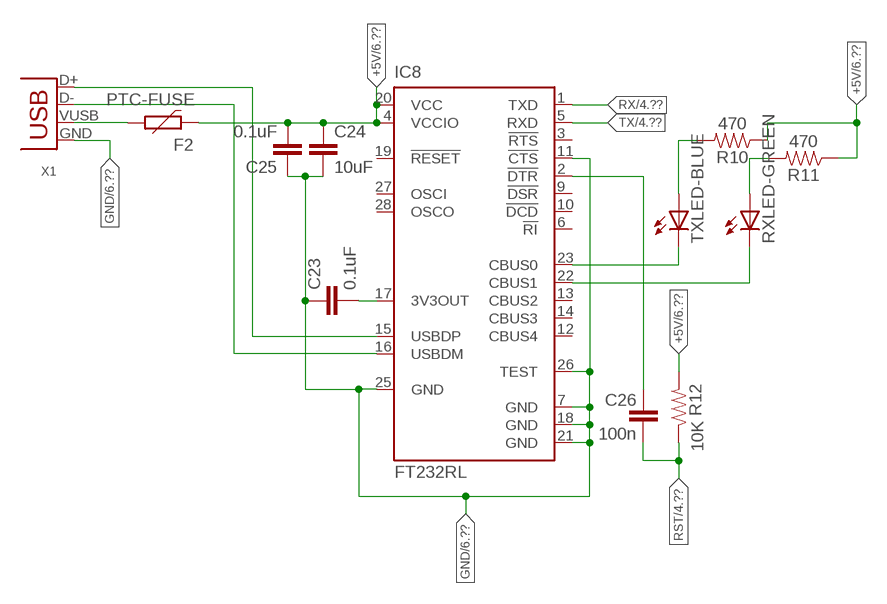
[diagram p4: schematic, sheet 5]

### Parts
C23  0.1uF  0.1UF-0603-25V-(+80/-20%)  [0603]
C24  10uF  10UF-0603-6.3V-20%  [0603]
C25  0.1uF  0.1UF-0603-25V-(+80/-20%)  [0603]
C26  100n  CAP0603-CAP  [0603-CAP]
F2  PTC-FUSE  [1206]
IC8  FT232RL  [SSOP28]
R10  470  470OHM-0603-1/10W-1%  [0603]
R11  470  470OHM-0603-1/10W-1%  [0603]
R12  10K  RESISTOR0603-RES  [0603-RES]
RXLED-GREEN  LEDCHIP-LED0603  [CHIP-LED0603]
TXLED-BLUE  LEDCHIP-LED0603  [CHIP-LED0603]
X1  USB-B-S  [USB-B-SMT]

### Nets
+5V: C24.1 C25.2 F2.1 IC8.4(VCCIO) IC8.20(VCC) R10.1 R11.1 R12.2 ; also sheet 2,3,4,6
DTR: C26.2 IC8.2(!DTR)
GND: C23.1 C24.2 C25.1 IC8.7(GND) IC8.11(!CTS) IC8.18(GND) IC8.21(GND) IC8.25(GND) IC8.26(TEST) X1.GND ; also sheet 1,2,3,4,6
N$114: R10.2 TXLED-BLUE.A
N$117: R11.2 RXLED-GREEN.A
N$118: IC8.23(CBUS0) TXLED-BLUE.C
N$119: IC8.22(CBUS1) RXLED-GREEN.C
N$120: F2.2 X1.VUSB(VBUS)
N$121: IC8.15(USBDP) X1.D+
N$122: IC8.16(USBDM) X1.D-
N$123: C23.2 IC8.17(3V3OUT)
RST: C26.1 R12.1 ; also sheet 4
RX: IC8.1(TXD) ; also sheet 4
TX: IC8.5(RXD) ; also sheet 4
Unconnected: IC8.3(!RTS) IC8.6(!RI) IC8.9(!DSR) IC8.10(!DCD) IC8.12(CBUS4) IC8.13(CBUS2) IC8.14(CBUS3) IC8.19(!RESET) IC8.27(OSCI) IC8.28(OSCO)

## Sheet 6 of 6: power supply
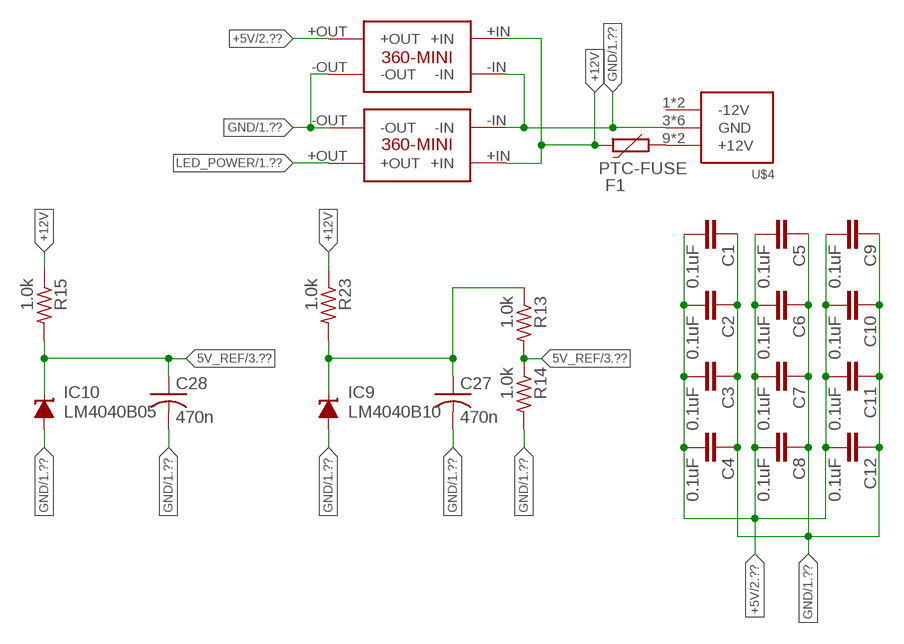
[diagram p5: schematic, sheet 6]

### Parts
C1  0.1uF  0.1UF-0603-25V-(+80/-20%)  [0603]
C2  0.1uF  0.1UF-0603-25V-(+80/-20%)  [0603]
C3  0.1uF  0.1UF-0603-25V-(+80/-20%)  [0603]
C4  0.1uF  0.1UF-0603-25V-(+80/-20%)  [0603]
C5  0.1uF  0.1UF-0603-25V-(+80/-20%)  [0603]
C6  0.1uF  0.1UF-0603-25V-(+80/-20%)  [0603]
C7  0.1uF  0.1UF-0603-25V-(+80/-20%)  [0603]
C8  0.1uF  0.1UF-0603-25V-(+80/-20%)  [0603]
C9  0.1uF  0.1UF-0603-25V-(+80/-20%)  [0603]
C10  0.1uF  0.1UF-0603-25V-(+80/-20%)  [0603]
C11  0.1uF  0.1UF-0603-25V-(+80/-20%)  [0603]
C12  0.1uF  0.1UF-0603-25V-(+80/-20%)  [0603]
C27  470n  C-USC0603  [C0603]
C28  470n  C-USC0603  [C0603]
F1  PTC-FUSE  [1206]
IC9  LM4040B10  LM4041B12DBZ  [DBZ_R-PDSO-G3]
IC10  LM4040B05  LM4041B12DBZ  [DBZ_R-PDSO-G3]
R13  1.0k  R-US_R0603  [R0603]
R14  1.0k  R-US_R0603  [R0603]
R15  1.0k  R-US_R0603  [R0603]
R23  1.0k  R-US_R0603  [R0603]
U$4  POWER_SIMPLE10  [POWER_10]
U$5  MINI-360SMD  [MINI-360SMD]
U$6  MINI-360SMD  [MINI-360SMD]

### Nets
5V_REF: C28.1 IC10.1(C) R13.2 R14.1 R15.2 ; also sheet 3
+5V: C1.2 C2.2 C3.2 C4.2 C5.2 C6.2 C7.2 C8.2 C9.2 C10.2 C11.2 C12.2 U$6.+OUT ; also sheet 2,3,4,5
+12V: F1.1 R15.1 R23.1 U$5.+IN U$6.+IN
AREF: C27.1 IC9.1(C) R13.1 R23.2
GND: C1.1 C2.1 C3.1 C4.1 C5.1 C6.1 C7.1 C8.1 C9.1 C10.1 C11.1 C12.1 C27.2 C28.2 IC9.2(A) IC10.2(A) R14.2 U$4.3(GND) U$4.4(GND) U$4.5(GND) U$4.6(GND) U$4.7(GND) U$4.8(GND) U$5.-IN U$5.-OUT U$6.-IN U$6.-OUT ; also sheet 1,2,3,4,5
LED_POWER: U$5.+OUT ; also sheet 1
N$101: F1.2 U$4.9(+12V) U$4.10(+12V)
Unconnected: U$4.1(-12V) U$4.2(-12V)

## Library data of the parts
BRIG_ADJUST TEMP_ADJUST VAR_ADJ0 VAR_ADJ1 = resistor:R-TRIMM: Trimm resistor
C1-C23 C25 = SparkFun-Capacitors:0.1UF: 0.1µF ceramic capacitors A capacitor is a passive two-terminal electrical component used to store electrical energy temporarily in an electric field.; PROD_ID: CAP-00810
C24 = SparkFun-Capacitors:10UF: 10.0µF ceramic capacitors A capacitor is a passive two-terminal electrical component used to store electrical energy temporarily in an electric field.; PROD_ID: CAP-11015
C26 = SparkFun:CAP: Capacitor Standard 0603 ceramic capacitor, and 0.1" leaded capacitor.
C27 C28 = rcl:C-US: CAPACITOR, American symbol
CLOCK_IN CLOCK_OUT CV_OUT1-CV_OUT8 RESET_IN RESET_OUT TRIG/GATE_OUT1-TRIG/GATE_OUT8 = thonkiconn:WQP-PJ301M-12_JACK
D1 = adafruit:DIODE: Diode SMADIODE - SMA Surface Mount Package 20V 1A Schottky Diode Digikey: 641-1014-6-ND DO-1N4148 - Through Hole Small Current Diode SOD-123 20V 1 A (.5mV Vf) Schottky Diode - Digikey: MBRX120TPMSCT-ND SOD-323 10V 570mA (.38mV Vf, 3ns) Schottky Diode - Digikey: ZLLS410CT-ND SOD-523 30V 30mA Schottky Diode (RB751S-40TE61) - Digikey: RB751S-40TE61CT-ND SOT23-R/W - SOT23 Package (R = Solder Paste/Reflow Ovens, W = Hand-Soldering) BAT54Film 40V 300mA - Digikey: 497-7162-1-ND
F1 F2 = ptc-fuse-1206-smd:PTC-FUSE
IC1 = 40xx:4017: COUNTER/DIVIDER
IC2 IC3 IC7 = 40xx:4051: 8-channel ANALOG MULTIPLEXER
IC4 IC6 = 74xx-eu:74*595: 8-bit SHIFT REGISTER, output latch
IC5 = 40xx:4053: Triple 2-channel ANALOG MULTIPLEXER
IC8 = ftdichip:FT232R: Source: http://www.ftdichip.com/Documents/DataSheets/DS_FT232R_v104.pdf; MPN: FT232RL; OC_FARNELL: 1146032; OC_NEWARK: 91K9918
IC9 IC10 = texas:LM4041: PRECISION MICROPOWER SHUNT VOLTAGE REFERENCE Source: http://focus.ti.com/lit/ds/slcs146e/slcs146e.pdf
LED1-LED72 = adafruit:WS2812B
LED73-LED80 = led:LED: LED
R1 R2 = SparkFun-Resistors:10KOHM: 10kΩ resistor A resistor is a passive two-terminal electrical component that implements electrical resistance as a circuit element. Resistors act to reduce current flow, and, at the same time, act to lower voltage levels within circuits. - Wikipedia; PROD_ID: RES-00824
R3-R11 R27 = SparkFun-Resistors:470OHM: 470Ω resistor A resistor is a passive two-terminal electrical component that implements electrical resistance as a circuit element. Resistors act to reduce current flow, and, at the same time, act to lower voltage levels within circuits. - Wikipedia; PROD_ID: RES-07869
R12 = SparkFun:RESISTOR: Resistor Basic schematic elements and footprints for 0603, 1206, and PTH resistors.
R13-R15 R23 = rcl:R-US_: RESISTOR, American symbol
RXLED-GREEN TXLED-BLUE = adafruit:LED: LED
S1-S72 = encoders switches:MOMENTARY-SWITCH-SPST: Momentary Switch (Pushbutton) - SPST Normally-open (NO) SPST momentary switches (buttons, pushbuttons). Variants PTH-12MM - 12mm square, through-hole Momentary Pushbutton Switch - 12mm Square <https://www.sparkfun.com/products/9190> (COM-09190) PTH-6.0MM, PTH-6.0MM-KIT - 6.0mm square, through-hole Mini Pushbutton Switch <https://www.sparkfun.com/products/97> (COM-00097) KIT package intended for soldering kit's - only one side of pads' copper is exposed. PTH-RIGHT-ANGLE-KIT - Right-angle, through-hole Right Angle Tactile Button <https://www.sparkfun.com/products/10791> - Used on SparkFun BigTime Watch Kit <https://www.sparkfun.com/products/11734> SMD-12MM - 12mm square, surface-mount Tactile Button - SMD (12mm) <https://www.sparkfun.com/products/12993> (COM-12993) Used on SparkFun PicoBoard <https://www.sparkfun.com/products/11888> SMD-4.5MM - 4.5mm Square Trackball Switch Used on SparkFun Blackberry Trackballer Breakout <https://www.sparkfun.com/products/13169> SMD-4.6MMX2.8MM - 4.60mm x 2.80mm, surface mount Used on SparkFun SAMD21 Mini Breakout <https://www.sparkfun.com/products/13664> SMD-5.2MM, SMD-5.2-REDUNDANT - 5.2mm square, surface-mount Mini Pushbutton Switch - SMD <https://www.sparkfun.com/products/8720> (COM-08720) Used on Arduino Pro Mini <https://www.sparkfun.com/products/11114> REDUNDANT package connects both switch circuits together SMD-6.0X3.5MM - 6.0 x 3.5mm, surface mount Momentary Reset Switch SMD <https://www.sparkfun.com/products/8229> (COM-08229) SMD-6.2MM-TALL - 6.2mm square, surface mount Tactile Button - SMD (6mm) <https://www.sparkfun.com/products/12992> Used on SparkFun Digital Sandbox <https://www.sparkfun.com/products/12651> SMD-RIGHT-ANGLE - Right-angle, surface mount Used on SparkFun Block for Intel® Edison - Arduino <https://www.sparkfun.com/products/13036>; PROD_ID: SWCH-00815; SF_SKU: COM-08229
S73 = SparkFun-Switches:ENCODER-SWITCH: Rotary Encoder w/ Select Switch Encoders rotate similarly to potentiometers, but they’re different from potentiometers in that an encoder has full rotation without limits. They output gray code so that you can tell how much and in which direction the encoder has been turned. This encoder includes a push-down select switch built into the shaft. SparkFun Products Rotary Encoder <https://www.sparkfun.com/products/9117> (COM-09117); SF_SKU: COM-09117
U$1 = temp_sensors:AD22100
U$2 = dac:AD5328
U$3 = Arduino-clone:ABK-PRO-MINI: ABK Pro-Mini Arduino Clone
U$4 = eurorack:POWER_SIMPLE
U$5 U$6 = regulators:MINI-360
X1 = con-usb-3:USB: USB Connectors

## Net classes
0 default: width 0.254 mm
1 LED_POWER: width 0.305 mm